# EAGLE design sensor_board_v0.91 (EAGLE 8.0.2)
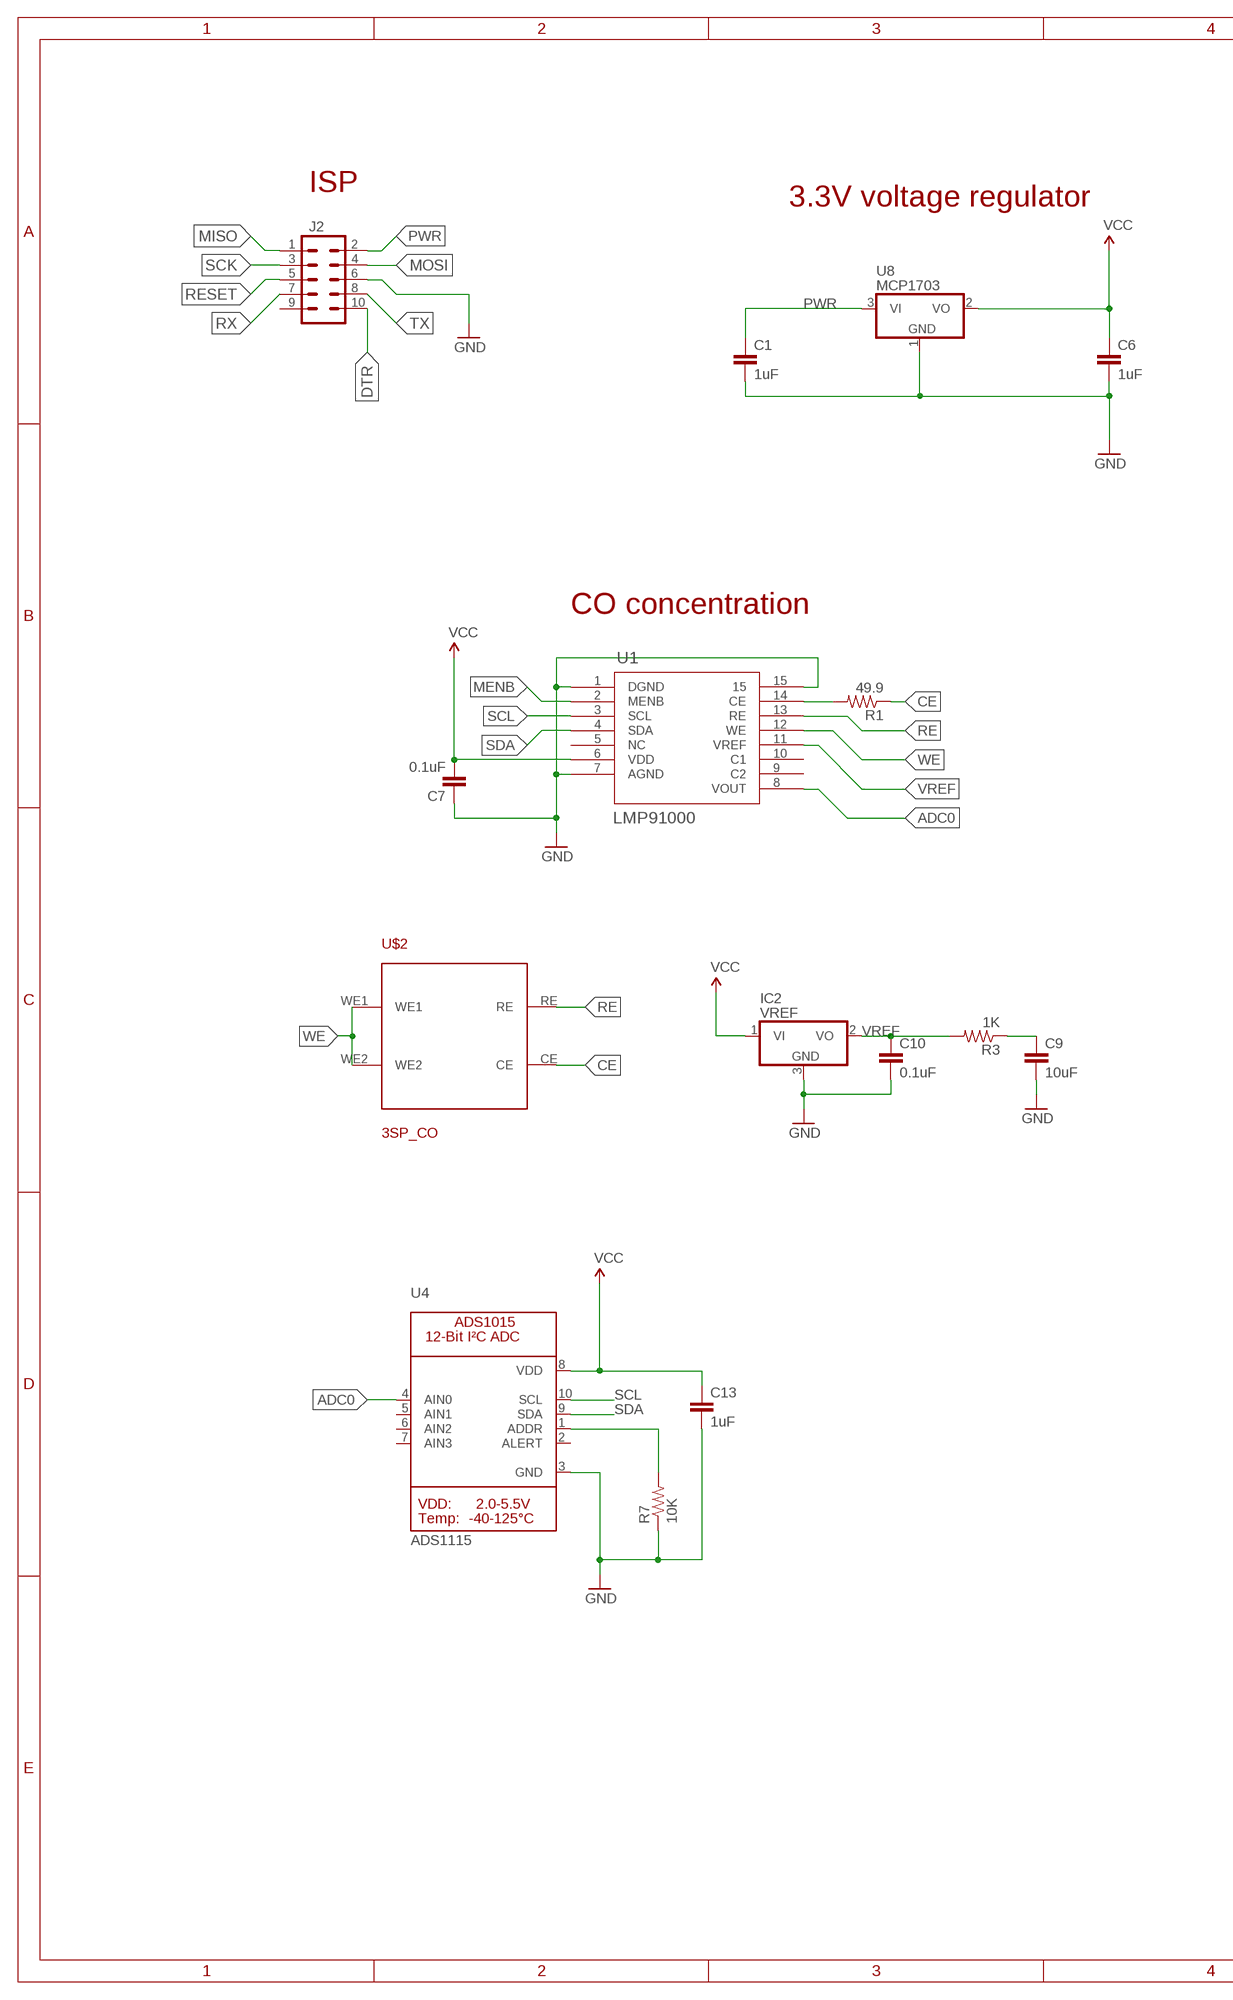
[diagram p0: schematic, sheet 1, part 1 of 2]
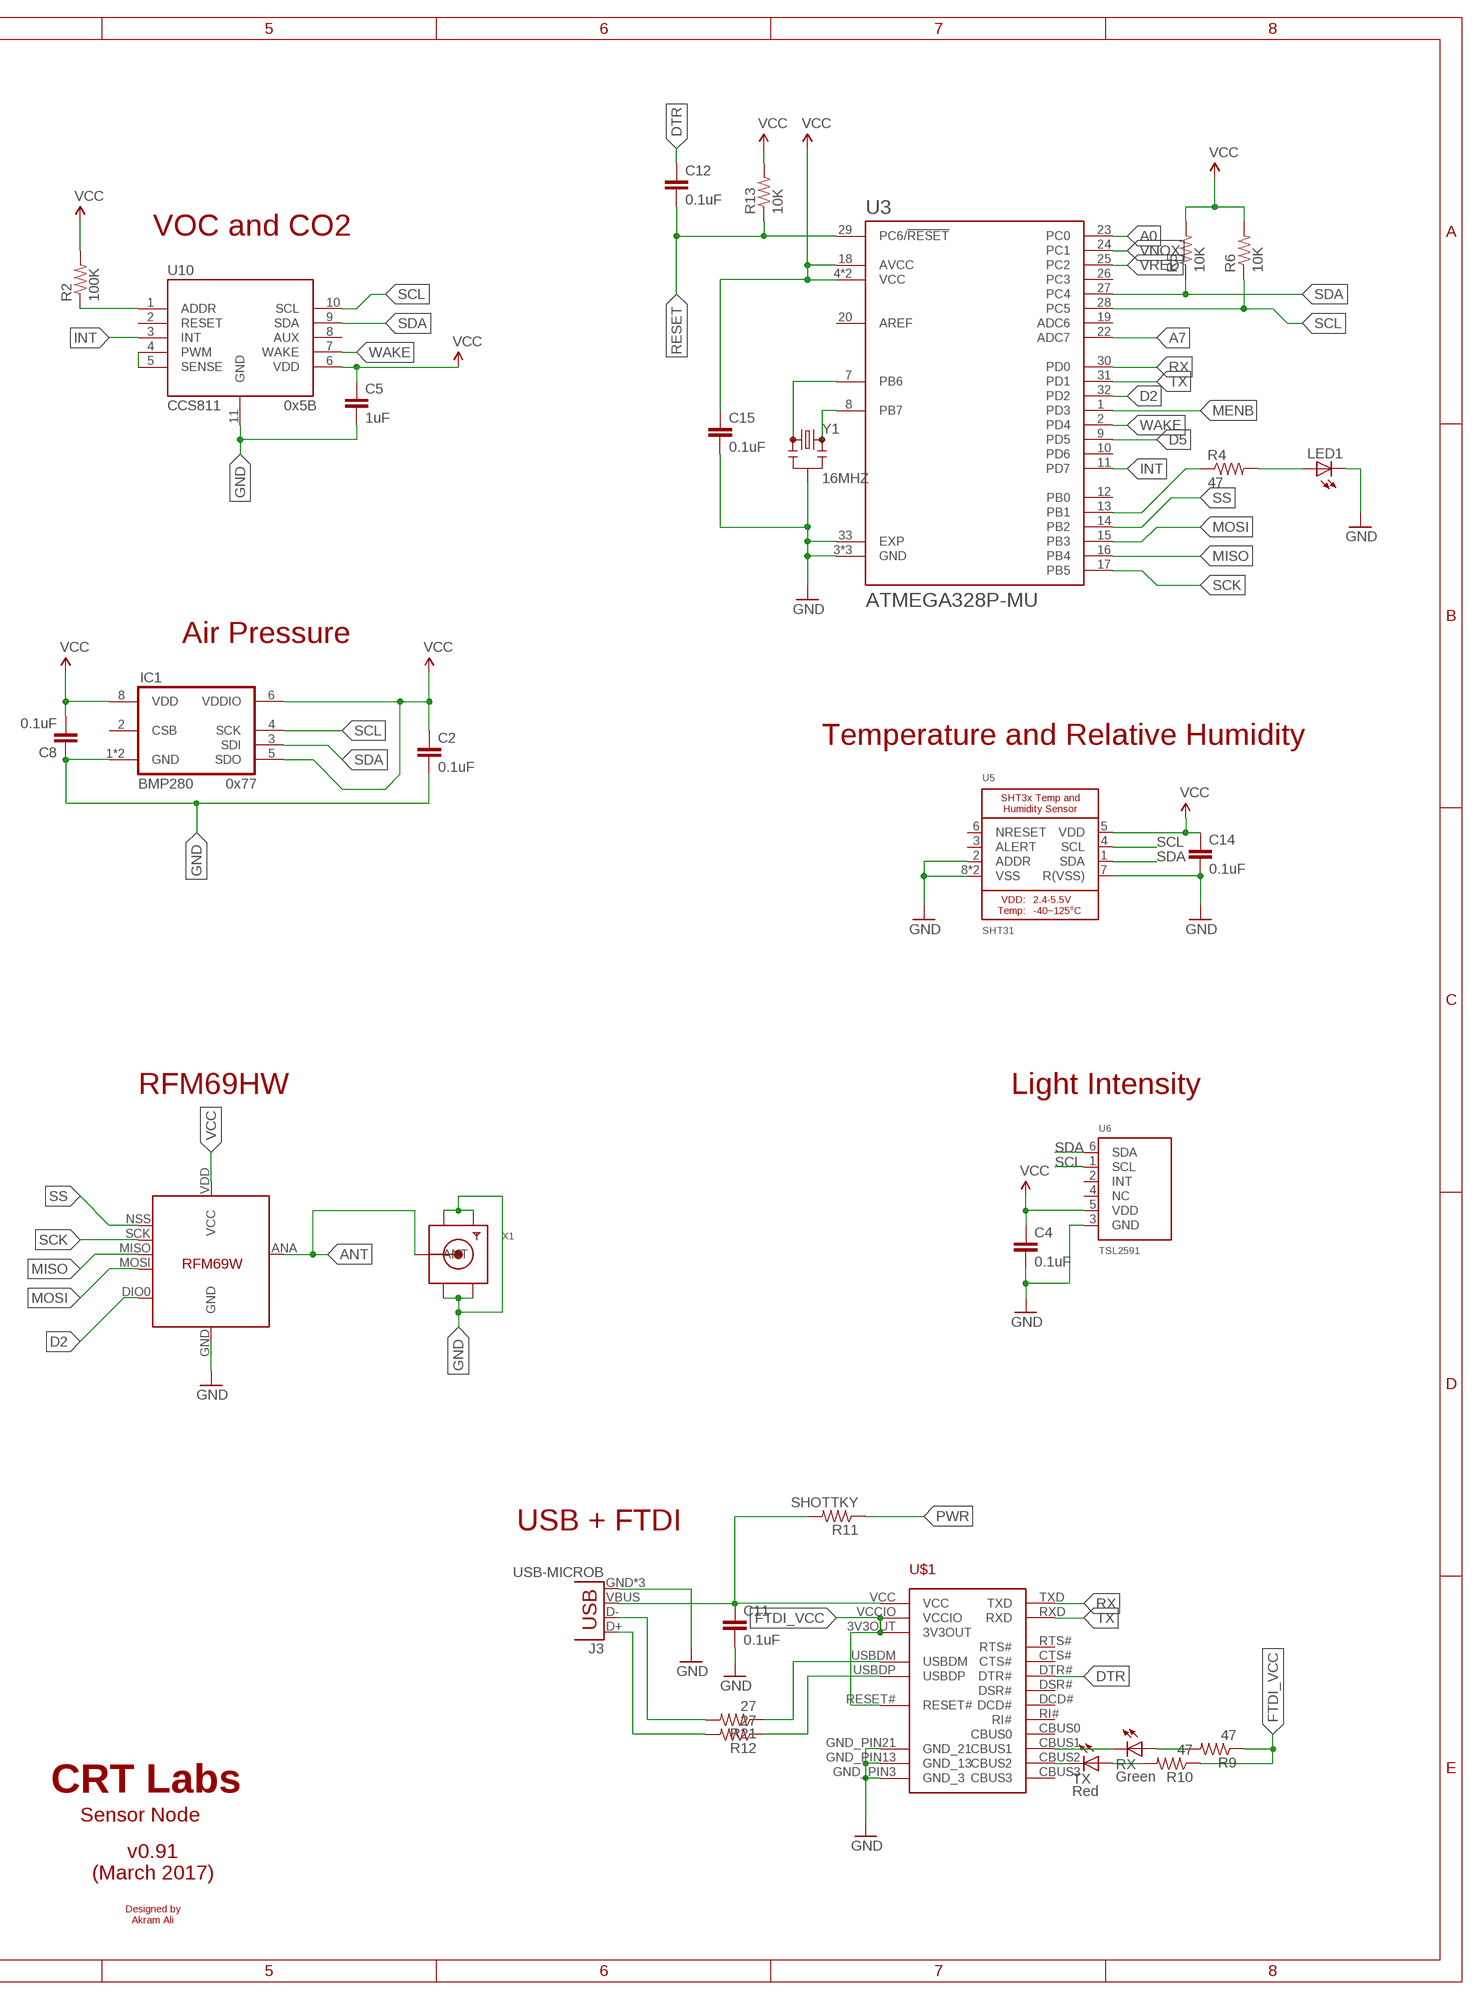
[diagram p1: schematic, sheet 1, part 2 of 2]

## Parts
C1  1uF  CAP0805  [0805]
C2  0.1uF  CAP0805  [0805]
C4  0.1uF  CAP0805  [0805]
C5  1uF  CAP0805  [0805]
C6  1uF  CAP0805  [0805]
C7  0.1uF  CAP0805  [0805]
C8  0.1uF  CAP0805  [0805]
C9  10uF  CAP0805  [0805]
C10  0.1uF  CAP0805  [0805]
C11  0.1uF  CAP0805  [0805]
C12  0.1uF  CAP0805  [0805]
C13  1uF  CAP0805  [0805]
C14  0.1uF  CAP0805  [0805]
C15  0.1uF  CAP0805  [0805]
IC1  BMP280  [BMP280]
IC2  VREF  ISL60002DIH320ZCB  [SOT23]
J2  M05X2PTH  [AVR_ICSP]
J3  USB-MICROB  [USB-MICROB]
LED1  LEDCHIPLED_0805  [CHIPLED_0805]
R1  49.9  RESISTOR0805-RES  [0805]
R2  100K  RESISTOR0805-RES  [0805]
R3  1K  RESISTOR0805-RES  [0805]
R4  47  RESISTOR0805-RES  [0805]
R5  10K  RESISTOR0805-RES  [0805]
R6  10K  RESISTOR0805-RES  [0805]
R7  10K  RESISTOR0805-RES  [0805]
R9  47  RESISTOR0805-RES  [0805]
R10  47  RESISTOR0805-RES  [0805]
R11  SHOTTKY  RESISTOR0805-RES  [0805]
R12  27  RESISTOR0805-RES  [0805]
R13  10K  RESISTOR0805-RES  [0805]
R21  27  RESISTOR0805-RES  [0805]
RX  Green  LEDCHIPLED_0805  [CHIPLED_0805]
TX  Red  LEDCHIPLED_0805  [CHIPLED_0805]
U1  LMP91000  LMP91000_NHL_14  [SDA14B]
U3  ATMEGA328P-MU  [QFN50P500X500X100-33N]
U4  ADS1115  ADC_ADS1015  [MSOP10]
U5  SHT31  SHT3X  [SHT3X]
U6  TSL2591  LIGHT_TSL2591  [DFN6_TAOS]
U8  MCP1703  MCP1703CB  [SOT23]
U10  CCS811  CCS811-I2C  [LGA]
U11  RFM69HW  LOWPOWERLAB_RFM69  [LOWPOWERLAB_RFM69W-MINPADS]
U$1  FT231XQ-R  [FTDI_FT231XQ-R_PACKAGE]
U$2  3SP_CO  [3SP_CO_PIN_PACKAGE]
X1  SMACONNECTOR_EDGE  [SMA_EDGELAUNCH]
Y1  16MHZ  RESONATOR16MHZ  [RESONATOR-SMD]

## Nets
A0: U3.23(PC0)
A7: U3.22(ADC7)
ADC0: U1.8(VOUT) U4.4(AIN0)
ANT: U11.ANA(ANT) X1.P(ANT)
CE: R1.1 U$2.CE
D2: U3.32(PD2) U11.DIO0
D5: U3.9(PD5)
DTR: C12.1 J2.10 U$1.DTR#
FTDI_VCC: R9.1 R10.1 U$1.3V3OUT U$1.RESET# U$1.VCCIO
GND: C1.2 C2.2 C4.2 C5.2 C6.2 C7.1 C8.1 C9.2 C10.2 C11.2 C13.2 C14.2 C15.2 IC1.1(GND) IC1.7(GND) IC2.3(GND) J2.6 J3.GND J3.MT1(GND) J3.MT2(GND) LED1.C R7.1 U1.1(DGND) U1.7(AGND) U1.15 U3.3(GND) U3.5(GND) U3.21(GND) U3.33(EXP) U4.3(GND) U5.2(ADDR) U5.7(R(VSS)) U5.8(VSS) U5.THERMAL(VSS) U6.3(GND) U8.1(GND) U10.11(GND) U11.GND U$1.GND_PIN3(GND_3) U$1.GND_PIN13(GND_13) U$1.GND_PIN21(GND_21) X1.GND@1(GND4) X1.GND@2(GND3) X1.GND@3(GND2) X1.GND@4(GND1) Y1.2
INT: U3.11(PD7) U10.3(INT)
MENB: U1.2(MENB) U3.1(PD3)
MISO: J2.1 U3.16(PB4) U11.MISO
MOSI: J2.4 U3.15(PB3) U11.MOSI
N$1: R2.1 U10.1(ADDR)
N$2: R4.1 U3.13(PB1)
N$3: LED1.A R4.2
N$4: U3.8(PB7) Y1.3
N$5: U3.7(PB6) Y1.1
N$6: U10.4(PWM) U10.5(SENSE)
N$9: R1.2 U1.14(CE)
N$10: C9.1 R3.1
N$13: R7.2 U4.1(ADDR)
N$17: RX.C U$1.CBUS1
N$18: TX.C U$1.CBUS2
N$25: R21.1 U$1.USBDM
N$26: R12.1 U$1.USBDP
N$27: R9.2 RX.A
N$29: R10.2 TX.A
N$32: J3.D- R21.2
N$33: J3.D+ R12.2
PWR: C1.1 J2.2 R11.1 U8.3(VI)
RE: U1.13(RE) U$2.RE
RESET: C12.2 J2.5 R13.1 U3.29(PC6/!RESET)
RX: J2.7 U3.30(PD0) U$1.TXD
SCK: J2.3 U3.17(PB5) U11.SCK
SCL: IC1.4(SCK) R6.1 U1.3(SCL) U3.28(PC5) U4.10(SCL) U5.4(SCL) U6.1(SCL) U10.10(SCL)
SDA: IC1.3(SDI) R5.1 U1.4(SDA) U3.27(PC4) U4.9(SDA) U5.1(SDA) U6.6(SDA) U10.9(SDA)
SS: U3.14(PB2) U11.NSS(SEL)
TX: J2.8 U3.31(PD1) U$1.RXD
VBUS: C11.1 J3.VBUS R11.2 U$1.VCC
VCC: C2.1 C4.1 C5.1 C6.1 C7.2 C8.2 C13.1 C14.1 C15.1 IC1.5(SDO) IC1.6(VDDIO) IC1.8(VDD) IC2.1(VI) R2.2 R5.2 R6.2 R13.2 U1.6(VDD) U3.4(VCC) U3.6(VCC) U3.18(AVCC) U4.8(VDD) U5.5(VDD) U6.5(VDD) U8.2(VO) U10.6(VDD) U11.VDD(VCC)
VNOX: U3.24(PC1)
VRED: U3.25(PC2)
VREF: C10.1 IC2.2(VO) R3.2 U1.11(VREF)
WAKE: U3.2(PD4) U10.7(WAKE)
WE: U1.12(WE) U$2.WE1 U$2.WE2
Unconnected: IC1.2(CSB) J2.9 U1.5(NC) U1.9(C2) U1.10(C1) U3.10(PD6) U3.12(PB0) U3.19(ADC6) U3.20(AREF) U3.26(PC3) U4.2(ALERT) U4.5(AIN1) U4.6(AIN2) U4.7(AIN3) U5.3(ALERT) U5.6(NRESET) U6.2(INT) U6.4(NC) U10.2(RESET) U10.8(AUX) U$1.CBUS0 U$1.CBUS3 U$1.CTS# U$1.DCD# U$1.DSR# U$1.RI# U$1.RTS#

## Notes on the sheet
- ISP
- 3.3V voltage regulator
- VOC and CO2
- 0x5B
- CO concentration
- Air Pressure
- Temperature and Relative Humidity
- 0x77
- RFM69HW | Light Intensity
- USB + FTDI
- CRT Labs
- Sensor Node
- v0.91
  (March 2017)
- Designed by
  Akram Ali

## Library data of the parts
C1 C6 = SparkFun-Capacitors:CAP: Capacitor Standard 0603 ceramic capacitor, and 0.1" leaded capacitor.; MPN: CC0805KKX7R7BB105
C2 C4 C7 C8 C10 C12 C14 C15 = SparkFun-Passives:CAP: Capacitor Standard 0603 ceramic capacitor, and 0.1" leaded capacitor.; MPN: AC0805KRX7R9BB104
C5 C13 = SparkFun-Passives:CAP: Capacitor Standard 0603 ceramic capacitor, and 0.1" leaded capacitor.; MPN: CC0805KKX7R7BB105
C9 = SparkFun-Passives:CAP: Capacitor Standard 0603 ceramic capacitor, and 0.1" leaded capacitor.; MPN: CC0805ZKY5V6BB106
C11 = SparkFun-Capacitors:CAP: Capacitor Standard 0603 ceramic capacitor, and 0.1" leaded capacitor.; MPN: AC0805KRX7R9BB104
IC1 = bosch-bmp280:BMP280: The BMP280 is an absolute barometric pressure sensor especially designed for mobile applications. The sensor module is housed in an extremely compact 8-pin metal-lid LGA package with a footprint of only 2.0 × 2.5 mm2 and 0.95 mm package height. Its small dimensions and its low power consumption of 2.7 μA @1Hz allow the implementation in battery driven devices such as mobile phones, GPS modules or watches. The library has been designed by Richard Magdycz <https://www.facebook.com/groups/eaglecadsoftUK>; MPN: BMP280
IC2 = linear:ISL60002DIH320Z: ISL60002DIH320Z; MPN: ISL60002DIH320Z-TK
J2 = SparkFun-Connectors:M05X2: Header 5x2 Standard 10-pin dual row 0.1" header. Commonly used with AVR-ISP. Use with Spark Fun Electronics SKU: PRT-00778; NO_BOM: TRUE
J3 = SparkFun-Connectors:USB: USB Connectors USB-B-PTH is fully proven SKU : PRT-00139/CONN-08278 USB-miniB is fully proven SKU : PRT-00587 USB-A-PCB is untested. USB-A-H is throughly reviewed, but untested. Spark Fun Electronics SKU : PRT-00437 USB-B-SMT is throughly reviewed, but untested. Needs silkscreen touching up. USB-A-S has not been used/tested USB-MB-H has not been used/tested USB-MICROB has been used. CONN-09505; MPN: CONN-09505; PROD_ID: CONN-09505
LED1 = adafruit:LED: LED OSRAM: - CHIPLED LG R971, LG N971, LY N971, LG Q971, LY Q971, LO R971, LY R971 LH N974, LH R974 LS Q976, LO Q976, LY Q976 LO Q996 - Hyper CHIPLED LW Q18S LB Q993, LB Q99A, LB R99A - SideLED LS A670, LO A670, LY A670, LG A670, LP A670 LB A673, LV A673, LT A673, LW A673 LH A674 LY A675 LS A676, LA A676, LO A676, LY A676, LW A676 LS A679, LY A679, LG A679 - Hyper Micro SIDELED® LS Y876, LA Y876, LO Y876, LY Y876 LT Y87S - SmartLED LW L88C, LW L88S LB L89C, LB L89S, LG L890 LS L89K, LO L89K, LY L89K LS L896, LA L896, LO L896, LY L896 - TOPLED LS T670, LO T670, LY T670, LG T670, LP T670 LSG T670, LSP T670, LSY T670, LOP T670, LYG T670 LG T671, LOG T671, LSG T671 LB T673, LV T673, LT T673, LW T673 LH T674 LS T676, LA T676, LO T676, LY T676, LB T676, LH T676, LSB T676, LW T676 LB T67C, LV T67C, LT T67C, LS T67K, LO T67K, LY T67K, LW E67C LS E67B, LA E67B, LO E67B, LY E67B, LB E67C, LV E67C, LT E67C LW T67C LS T679, LY T679, LG T679 LS T770, LO T770, LY T770, LG T770, LP T770 LB T773, LV T773, LT T773, LW T773 LH T774 LS E675, LA E675, LY E675, LS T675 LS T776, LA T776, LO T776, LY T776, LB T776 LHGB T686 LT T68C, LB T68C - Hyper Mini TOPLED® LB M676 - Mini TOPLED Santana® LG M470 LS M47K, LO M47K, LY M47K Source: http://www.osram.convergy.de/; MPN: 150080BS75000
R1 = SparkFun-Passives:RESISTOR: Resistor Basic schematic elements and footprints for 0603, 1206, and PTH resistors.; MPN: RC0805FR-0749R9L
R2 = SparkFun-Passives:RESISTOR: Resistor Basic schematic elements and footprints for 0603, 1206, and PTH resistors.; MPN: 311-100KCRCT-ND
R3 = SparkFun-Passives:RESISTOR: Resistor Basic schematic elements and footprints for 0603, 1206, and PTH resistors.; MPN: RC0805JR-071KL
R4 = SparkFun-Resistors:RESISTOR: Resistor Basic schematic elements and footprints for 0603, 1206, and PTH resistors.; MPN: RC0805JR-0747RL
R5-R7 = SparkFun-Resistors:RESISTOR: Resistor Basic schematic elements and footprints for 0603, 1206, and PTH resistors.; MPN: RC0805JR-0710KL
R9 R10 = SparkFun-Passives:RESISTOR: Resistor Basic schematic elements and footprints for 0603, 1206, and PTH resistors.; MPN: RC0805JR-0747RL
R11 = SparkFun-Passives:RESISTOR: Resistor Basic schematic elements and footprints for 0603, 1206, and PTH resistors.; MPN: SD0805S020S0R5
R12 R21 = SparkFun-Passives:RESISTOR: Resistor Basic schematic elements and footprints for 0603, 1206, and PTH resistors.; MPN: RC0805FR-0727RL
R13 = SparkFun-Passives:RESISTOR: Resistor Basic schematic elements and footprints for 0603, 1206, and PTH resistors.; MPN: RC0805JR-0710KL
RX = adafruit:LED: LED OSRAM: - CHIPLED LG R971, LG N971, LY N971, LG Q971, LY Q971, LO R971, LY R971 LH N974, LH R974 LS Q976, LO Q976, LY Q976 LO Q996 - Hyper CHIPLED LW Q18S LB Q993, LB Q99A, LB R99A - SideLED LS A670, LO A670, LY A670, LG A670, LP A670 LB A673, LV A673, LT A673, LW A673 LH A674 LY A675 LS A676, LA A676, LO A676, LY A676, LW A676 LS A679, LY A679, LG A679 - Hyper Micro SIDELED® LS Y876, LA Y876, LO Y876, LY Y876 LT Y87S - SmartLED LW L88C, LW L88S LB L89C, LB L89S, LG L890 LS L89K, LO L89K, LY L89K LS L896, LA L896, LO L896, LY L896 - TOPLED LS T670, LO T670, LY T670, LG T670, LP T670 LSG T670, LSP T670, LSY T670, LOP T670, LYG T670 LG T671, LOG T671, LSG T671 LB T673, LV T673, LT T673, LW T673 LH T674 LS T676, LA T676, LO T676, LY T676, LB T676, LH T676, LSB T676, LW T676 LB T67C, LV T67C, LT T67C, LS T67K, LO T67K, LY T67K, LW E67C LS E67B, LA E67B, LO E67B, LY E67B, LB E67C, LV E67C, LT E67C LW T67C LS T679, LY T679, LG T679 LS T770, LO T770, LY T770, LG T770, LP T770 LB T773, LV T773, LT T773, LW T773 LH T774 LS E675, LA E675, LY E675, LS T675 LS T776, LA T776, LO T776, LY T776, LB T776 LHGB T686 LT T68C, LB T68C - Hyper Mini TOPLED® LB M676 - Mini TOPLED Santana® LG M470 LS M47K, LO M47K, LY M47K Source: http://www.osram.convergy.de/; MPN: LG R971-KN-1
TX = adafruit:LED: LED OSRAM: - CHIPLED LG R971, LG N971, LY N971, LG Q971, LY Q971, LO R971, LY R971 LH N974, LH R974 LS Q976, LO Q976, LY Q976 LO Q996 - Hyper CHIPLED LW Q18S LB Q993, LB Q99A, LB R99A - SideLED LS A670, LO A670, LY A670, LG A670, LP A670 LB A673, LV A673, LT A673, LW A673 LH A674 LY A675 LS A676, LA A676, LO A676, LY A676, LW A676 LS A679, LY A679, LG A679 - Hyper Micro SIDELED® LS Y876, LA Y876, LO Y876, LY Y876 LT Y87S - SmartLED LW L88C, LW L88S LB L89C, LB L89S, LG L890 LS L89K, LO L89K, LY L89K LS L896, LA L896, LO L896, LY L896 - TOPLED LS T670, LO T670, LY T670, LG T670, LP T670 LSG T670, LSP T670, LSY T670, LOP T670, LYG T670 LG T671, LOG T671, LSG T671 LB T673, LV T673, LT T673, LW T673 LH T674 LS T676, LA T676, LO T676, LY T676, LB T676, LH T676, LSB T676, LW T676 LB T67C, LV T67C, LT T67C, LS T67K, LO T67K, LY T67K, LW E67C LS E67B, LA E67B, LO E67B, LY E67B, LB E67C, LV E67C, LT E67C LW T67C LS T679, LY T679, LG T679 LS T770, LO T770, LY T770, LG T770, LP T770 LB T773, LV T773, LT T773, LW T773 LH T774 LS E675, LA E675, LY E675, LS T675 LS T776, LA T776, LO T776, LY T776, LB T776 LHGB T686 LT T68C, LB T68C - Hyper Mini TOPLED® LB M676 - Mini TOPLED Santana® LG M470 LS M47K, LO M47K, LY M47K Source: http://www.osram.convergy.de/; MPN: LH R974-LP-1
U1 = LMP91000:LMP91000_NHL_14; BASEPN: LMP91000; DATASHEETURL: http://www.ti.com/lit/ds/symlink/lmp91000.pdf; DESCRIPTION: Configurable AFE Potentiostat for Low-Power Chemical Sensing Applications; MANUFACTURER: Texas Instruments; MANUFACTURER_PART_NUMBER: lmp91000_nhl_14; MPN: LMP91000; NSC_PACKAGEREFERENCE: SDA14B; VENDOR: Texas Instruments
U3 = ATMEGA328P-MU:ATMEGA328P-MU: ATmega Series 20 MHz 32 KB Flash 2 KB SRAM 8-Bit Microcontroller - QFN-32; AVAILABILITY: Good; DESCRIPTION: ATmega Series 20 MHz 32 KB Flash 2 KB SRAM 8-Bit Microcontroller - QFN-32; MF: Atmel; MP: ATMEGA328P-MU; MPN: ATMEGA328P-MU; PACKAGE: QFN-32 Atmel; PRICE: 2.55 USD
U4 = ADS1x15:ADC_ADS1015: ADS1015 - 12-bit 4-Channel I2C ADC with Internal PGA VDD: 2.0-5.5V Sampling Rate: 3.3ksps Gain Settings: 2/3, 1, 2, 4, 8, 16 I2C Address: ADDR low = 1001000x, ADDR high = 1001001x Internal Comparator The ADS1015 includes an internal comparator that can be set to output a high-level on ALERT when the conversion results exceeeds a pre-defined upper level, and will deassert itself when the level falls below a pre-defined lower threshold level. It can also be set to windowed mode where the ALERT pin will be asserted if the data exceeds the upper threshold or falls below the lower threshold.
U5 = SHT31:SHT3X: SHT3x - Digital Temperature and Humidity Sensor Supply Voltage: 2.4-5.5V Humidity Accuracy: SHT30 = +/-3%RH, SHT31 = +/-2%RH Temperature Sensor: -40~125°C (+/-0.3°C from 10-55C)
U6 = TSL2591:LIGHT_TSL2591: TSL2591 Light-To-Digital Sensor
U8 = linear:MCP1703: 250 mA, 16V, Low Quiescent Current LDO Regulator Source: http://ww1.microchip.com/downloads/en/DeviceDoc/22049b.pdf; MPN: MCP1703T-2502E/CB
U10 = CCS811:CCS811; MPN: CCS811
U11 = RFM69 USB Gateway:LOWPOWERLAB_RFM69; MPN: RFM69HW
U$1 = ftdi_ft231xq-r:FT231XQ-R: This is the 20-LD QFN package of the FTDI FT231XQ-R chip.; MPN: FT231XQ-R
U$2 = 3SP_CO:3SP_CO: Spec sensors - CO - Carbon Monoxide Sensor 1000 ppm Pinned Package http://www.spec-sensors.com/product/co-carbon-monoxide-sensor-1000-ppm/ Eagle symbol and footprint designed by Akram Ali https://github.com/AKstudios October 2016; MPN: 3SP CO
X1 = adafruit:SMACONNECTOR: SMA Connector 90° DIP SMA Connector, 50 Ohm (4UConnector: 07259); MPN: WRL-00593
Y1 = SparkFun-FreqCtrl:RESONATOR: Resonator Small SMD resonator. Used, eg, on the Arduino Pro/ Pro Mini boards. 8MHz- XTAL-08895 16MHz- XTAL-08900; MPN: CSTCE16M0V53-R0; PROD_ID: XTAL-08900

## Board
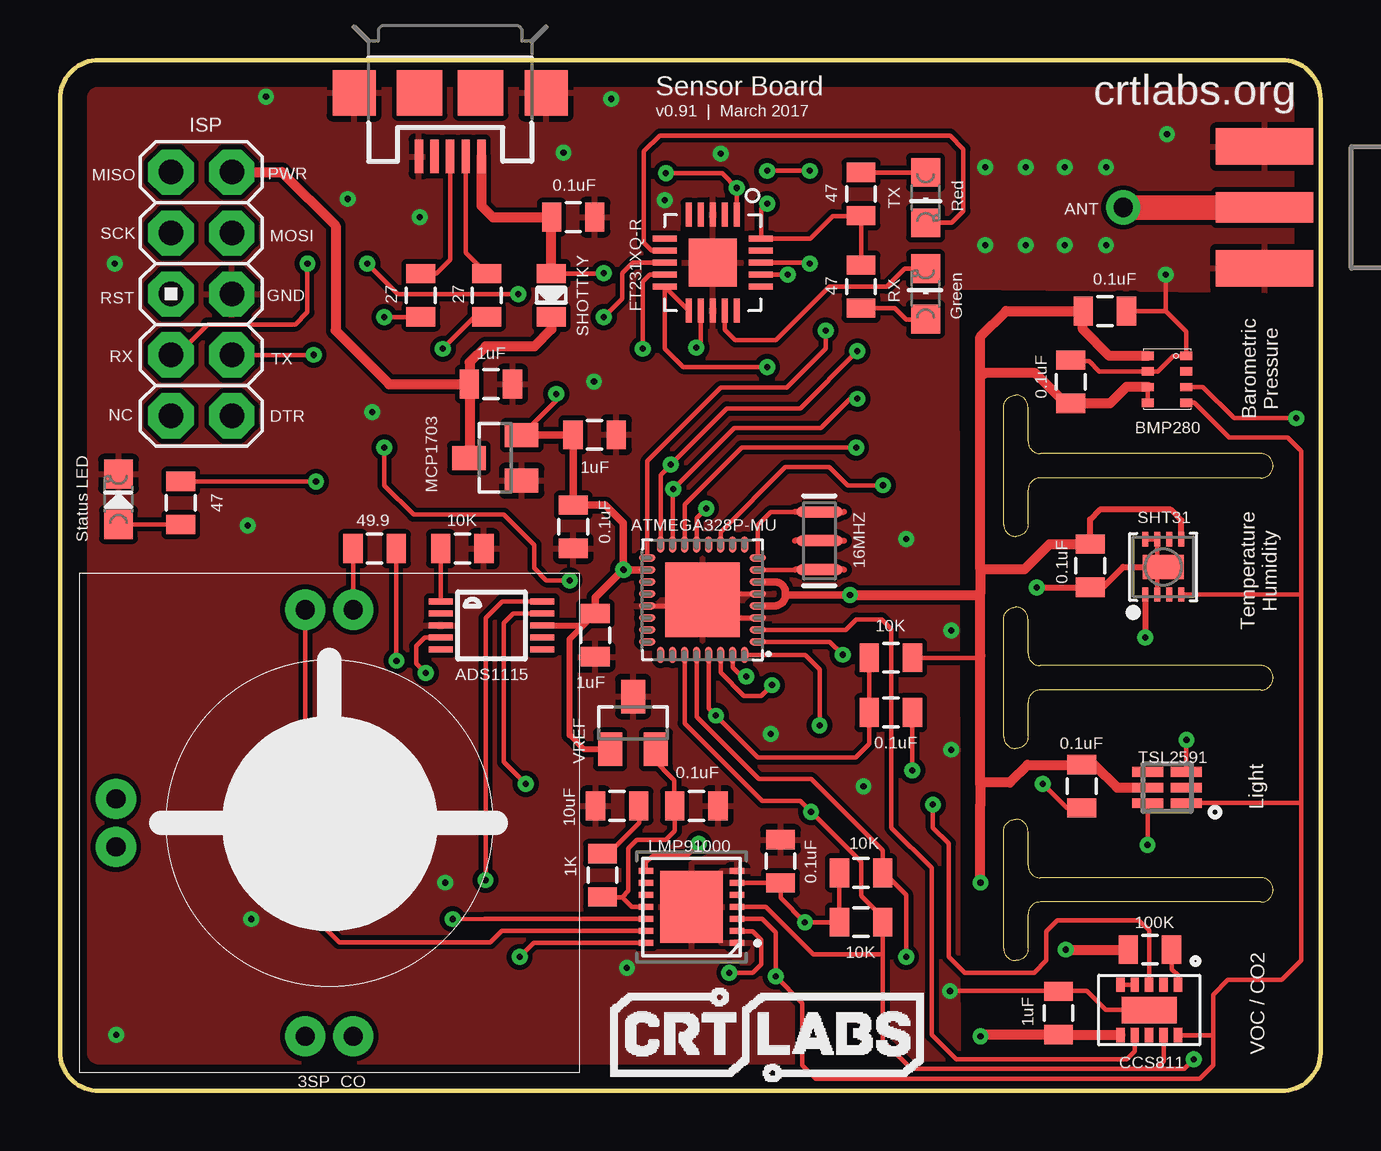
[diagram p2: board, top side]
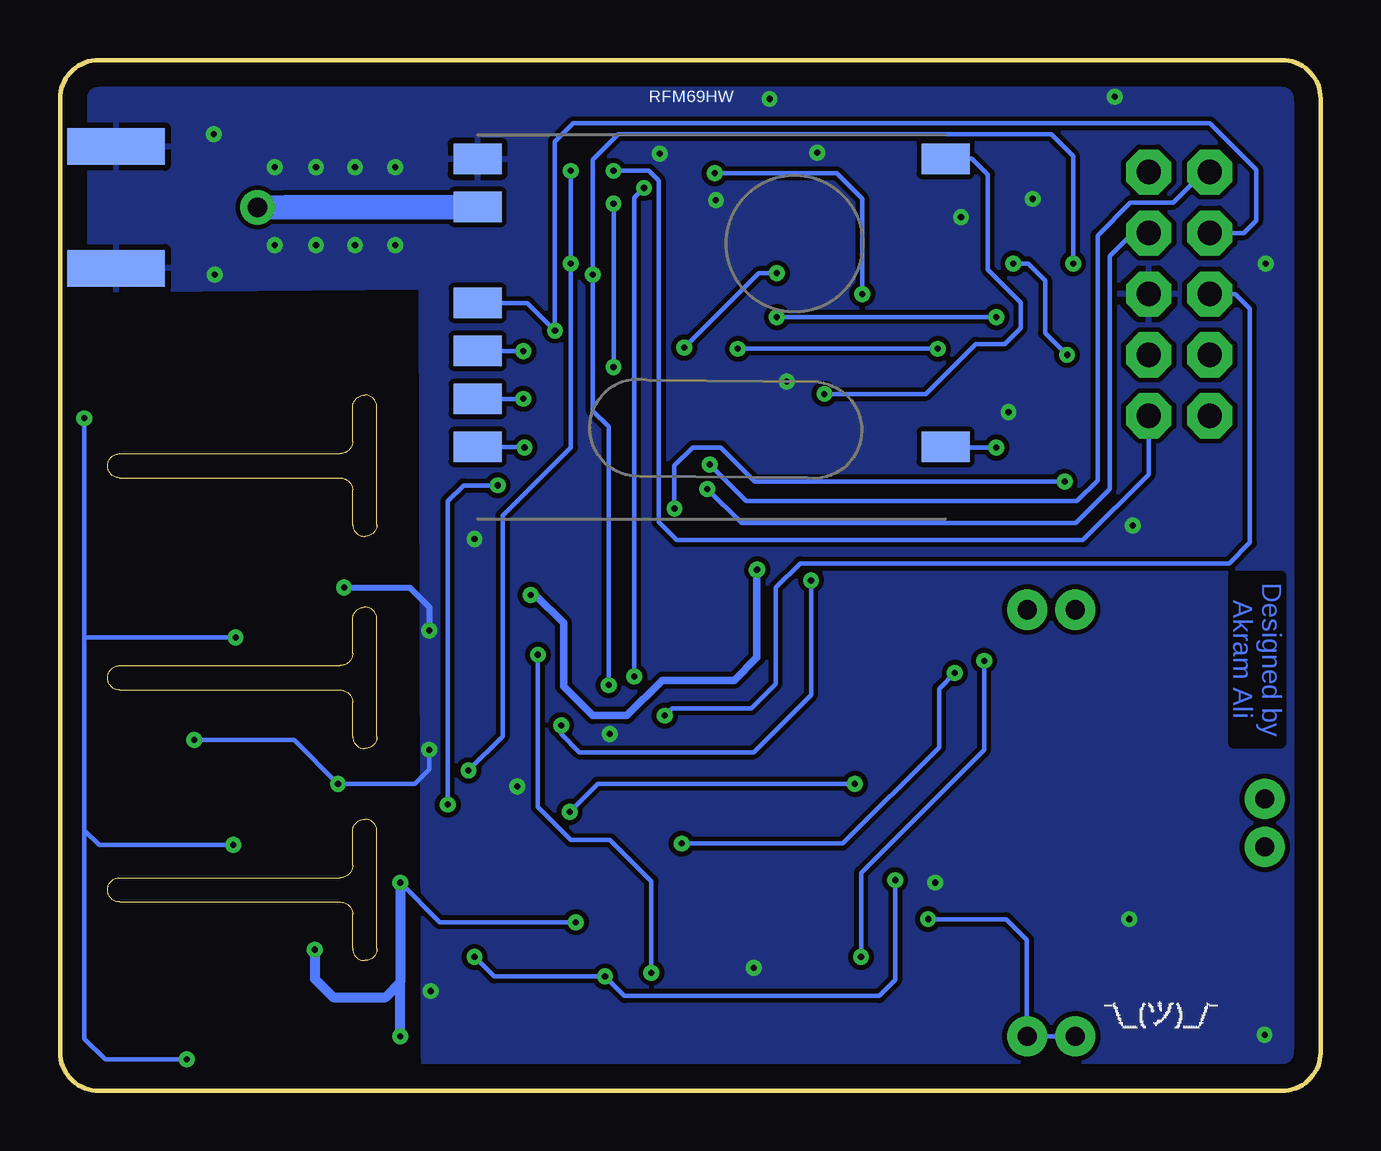
[diagram p3: board, bottom side, seen from below]

Size 52.53 x 42.98 mm. Coordinates in mm from the lower left corner, seen from the top.
Outline: 0,41.35 arc-90 1.63,42.98 50.95,42.98
Outline: 0,1.63 arc90 1.63,0 50.95,0
Outline: 0,41.4 0,1.52
Outline: 50.9,0 arc90 52.53,1.63
Outline: 50.9,42.98 arc-90 52.53,41.35 52.53,1.52
Outline: 50.04,8.89 40.84,8.89 arc-90 40.34,9.4 40.34,10.82 arc90 39.83,11.33 arc90 39.32,10.82 39.32,5.94 arc90 39.83,5.44 arc90 40.34,5.94 40.34,7.37 arc-90 40.84,7.87 50.04,7.87 arc90 50.55,8.38 arc90 50.04,8.89
Outline: 50.04,17.73 40.84,17.73 arc-90 40.34,18.24 40.34,19.66 arc90 39.83,20.17 arc90 39.32,19.66 39.32,14.78 arc90 39.83,14.27 arc90 40.34,14.78 40.34,16.21 arc-90 40.84,16.71 50.04,16.71 arc90 50.55,17.22 arc90 50.04,17.73
Outline: 50.04,26.57 40.84,26.57 arc-90 40.34,27.08 40.34,28.5 arc90 39.83,29.01 arc90 39.32,28.5 39.32,23.62 arc90 39.83,23.11 arc90 40.34,23.62 40.34,25.04 arc-90 40.84,25.55 50.04,25.55 arc90 50.55,26.06 arc90 50.04,26.57
Copper layers (1*16): Top 0.035mm / dielectric 1.5mm / Bottom 0.035mm
Design rules "default": minimum track width 10mil, minimum drill 24mil, track to track 8mil, track to pad 8mil, pad to pad 8mil, via to via 8mil, smd to smd 8mil, copper to edge 40mil, drill to drill 8mil, minimum pad ring 10mil, minimum via ring 8mil, stop-mask expansion 4mil, vias tented up to drill 0mil, thermal gap 10mil

### Footprints (pad centres in the part's own frame; a part is rotated, then mirrored left to right if it is on the bottom)
0805 = smd 0.8 x 1.2: 1 -0.9,0; 2 0.9,0
BMP280 = smd 0.35 x 0.5: 1 0.975,-0.8; 2 0.325,-0.8; 3 -0.325,-0.8; 4 -0.975,-0.8; 5 -0.975,0.8; 6 -0.325,0.8; 7 0.325,0.8; 8 0.975,0.8
SOT23 = smd 1 x 1.4: 1 -0.95,-1.1; 2 0.95,-1.1; 3 0,1.1
AVR_ICSP = drill 1.016 pad 1.88 octagon: 1 -1.27,5.08; 2 1.27,5.08; 3 -1.27,2.54; 4 1.27,2.54; 5 -1.27,0; 6 1.27,0; 7 -1.27,-2.54; 8 1.27,-2.54; 9 -1.27,-5.08; 10 1.27,-5.08
USB-MICROB = smd 0.35 x 1.4: D+ 0,2.65; D- -0.65,2.65; GND 1.3,2.65; ID 0.65,2.65; VBUS -1.3,2.65 | smd 1.8 x 1.9: MT1 -4,0; MT2 4,0 | smd 1.9 x 1.9: P$1 -1.27,0; P$2 1.27,0
CHIPLED_0805 = smd 1.2 x 1.2: A 0,-1.05; C 0,1.05
SDA14B = smd 0.6 x 0.25: 1 -1.9,1.5; 2 -1.9,1; 3 -1.9,0.5; 4 -1.9,0; 5 -1.9,-0.5; 6 -1.9,-1; 7 -1.9,-1.5; 8 1.9,-1.5; 9 1.9,-1; 10 1.9,-0.5; 11 1.9,0; 12 1.9,0.5; 13 1.9,1; 14 1.9,1.5 | smd 2.6 x 3: 15 0,0
QFN50P500X500X100-33N = smd 0.7 x 0.3: 1 -2.3,1.75; 2 -2.3,1.25; 3 -2.3,0.75; 4 -2.3,0.25; 5 -2.3,-0.25; 6 -2.3,-0.75; 7 -2.3,-1.25; 8 -2.3,-1.75; 17 2.3,-1.75; 18 2.3,-1.25; 19 2.3,-0.75; 20 2.3,-0.25; 21 2.3,0.25; 22 2.3,0.75; 23 2.3,1.25; 24 2.3,1.75 | smd 0.3 x 0.7: 9 -1.75,-2.3; 10 -1.25,-2.3; 11 -0.75,-2.3; 12 -0.25,-2.3; 13 0.25,-2.3; 14 0.75,-2.3; 15 1.25,-2.3; 16 1.75,-2.3; 25 1.75,2.3; 26 1.25,2.3; 27 0.75,2.3; 28 0.25,2.3; 29 -0.25,2.3; 30 -0.75,2.3; 31 -1.25,2.3; 32 -1.75,2.3 | smd 3.1 x 3.1: 33 0,0
MSOP10 = smd 0.25 x 1: 1 -1,-2.113; 2 -0.5,-2.113; 3 0,-2.113; 4 0.5,-2.113; 5 1,-2.113; 6 1,2.113; 7 0.5,2.113; 8 0,2.113; 9 -0.5,2.113; 10 -1,2.113
SHT3X = smd 0.6 x 0.25: 1 -1.15,0.75; 2 -1.15,0.25; 3 -1.15,-0.25; 4 -1.15,-0.75; 5 1.15,-0.75; 6 1.15,-0.25; 7 1.15,0.25; 8 1.15,0.75 | smd 1 x 1.7: THERMAL 0,0
DFN6_TAOS = smd 1.3 x 0.4: 1 -0.8,0.65; 2 -0.8,0; 3 -0.8,-0.65; 4 0.8,-0.65; 5 0.8,0; 6 0.8,0.65
LGA = smd 0.6 x 0.35: 1 0.3,3.2; 2 0.3,2.6; 3 0.3,2; 4 0.3,1.4; 5 0.3,0.8; 6 2.4,0.8; 7 2.4,1.4; 8 2.4,2; 9 2.4,2.6; 10 2.4,3.2 | smd 1.1 x 2.3: 11 1.35,2
LOWPOWERLAB_RFM69W-MINPADS = smd 2 x 1.27: ANA 8,-5; DIO0 -11.5,5; GND 8,-7; MISO 8,1; MOSI 8,3; NSS 8,5; SCK 8,-1; VDD -11.5,-7
FTDI_FT231XQ-R_PACKAGE = smd 0.25 x 1: 3V3OUT 0.968,-2.032; CBUS2 -0.532,-2.032; CBUS3 0.968,1.968; CTS# -1.032,-2.032; DTR# -0.032,1.968; RTS# -0.532,1.968; TXD 0.468,1.968; USBDM 0.468,-2.032; USBDP -0.032,-2.032; VCCIO -1.032,1.968 | smd 1 x 0.25: CBUS0 1.968,0.968; CBUS1 1.968,0.468; DCD# -2.032,-1.032; DSR# -2.032,-0.532; GND_PIN3 -2.032,-0.032; GND_PIN13 1.968,-0.032; RESET# 1.968,-1.032; RI# -2.032,0.468; RXD -2.032,0.968; VCC 1.968,-0.532 | smd 2 x 2: GND_PIN21 -0.032,-0.032
3SP_CO_PIN_PACKAGE = drill 0.8 pad 1.676: CE 11.41,19.3; P$3 1.52,11.41; P$4 1.52,9.41; RE 9.41,19.3; WE1 9.41,1.52; WE2 11.41,1.52
SMA_EDGELAUNCH = smd 4.064 x 1.524: GND@1 2.032,-2.54; GND@2 2.032,2.54 | smd 4.064 x 1.524 bottom: GND@3 2.032,2.54; GND@4 2.032,-2.54 | smd 4.064 x 1.27: P 2.032,0
RESONATOR-SMD = smd 0.45 x 1.905: 1 -1.2,0; 2 0,0; 3 1.2,0

### Placement (x,y rotation side)
C1  17.96,29.46 0 top
C2  42.11,29.57 90 top
C4  42.57,12.7 270 top
C5  41.61,3.25 90 top
C6  22.28,27.36 0 top
C7  30.02,9.58 270 top
C8  43.54,32.51 180 top
C9  23.22,11.89 180 top
C10  26.52,11.89 0 top
C11  21.39,36.42 0 top
C12  34.62,15.77 180 top
C13  22.3,19 270 top
C14  42.93,21.89 270 top
C15  21.39,23.52 270 top
IC1  46.13,29.67 90 top
IC2  23.88,15.34 0 top
J2  5.89,33.22 0 top
J3  16.26,41.61 180 top
LED1  2.44,24.66 0 top
R1  13.11,22.61 0 top
R2  45.42,5.89 180 top
R3  22.61,8.99 270 top
R4  5.03,24.51 270 top
R5  33.38,7.04 180 top
R6  33.38,9.09 180 top
R7  16.76,22.61 180 top
R9  33.38,33.53 270 top
R10  33.38,37.39 90 top
R11  20.47,33.17 90 top
R12  15.04,33.17 90 top
R13  34.62,18.06 0 top
R21  17.78,33.17 90 top
RX  36.07,33.22 0 top
TX  36.07,37.24 180 top
U1  26.31,7.67 180 top
U3  26.77,20.47 180 top
U4  17.98,19.41 270 top
U5  45.97,21.84 90 top
U6  46.13,12.65 180 top
U8  18.14,26.39 90 top
U10  43.38,4.72 270 top
U11  27.13,31.85 180 bottom
U$1  27.23,34.49 270 top
U$2  0.81,0.76 0 top
X1  52.22,36.83 180 top
Y1  31.65,22.94 90 top

### Tracks (layer width: path | path; a pad name or v marks a point on that pad's centre or on a via)
ADC0  (via drill 0.25 pad 0.13)
  Top 0.178: U1.8 24.41,9.53 24.69,9.8 26.11,9.8 v26.62,10.31 | v15.24,17.42 14.83,17.83 14.83,18.54 15.2,18.91 U4.4
  Bottom 0.178: v26.62,10.31 19.91,10.31 15.9,14.33 15.9,16.76 v15.24,17.42
ANT  (via drill 0.8 pad 1.42)
  Top 1.016: v44.3,36.83 X1.P
  Bottom 1.016: U11.ANA 43.11,36.85 v44.3,36.83
CE
  Top 0.178: U$2.CE 12.22,22.59 R1.1
D2  (via drill 0.25 pad 0.13)
  Top 0.178: U3.32 31.05,18.17 31.65,17.58 v31.65,15.24 | v13.51,26.82 13.51,25.25 14.73,24.03 18.49,24.03 19.76,22.76 19.76,21.79 20.27,21.29 v21.23,21.29
  Bottom 0.178: 15.65,26.83 U11.DIO0 15.6,26.82 v13.51,26.82 | v31.65,15.24 31.65,14.88 30.89,14.12 23.62,14.12 21.23,16.51 v21.23,21.29
DTR  (via drill 0.25 pad 0.13)
  Top 0.178: U$1.DTR# 31.21,34.53 v31.24,34.49 | v31.24,38.35 v29.46,38.35 | C12.1 35.52,13.37 v35.51,13.36
  Bottom 0.178: J2.10 7.16,25.7 9.91,22.96 26.82,22.96 27.58,23.72 27.58,37.95 27.99,38.35 v29.46,38.35 | v31.24,38.35 v31.24,34.49 31.24,26.82 34.09,23.98 34.09,14.78 v35.51,13.36
FTDI_VCC  (via drill 0.25 pad 0.13)
  Top 0.178: R9.1 R10.1 33.36,36.47 32.21,36.47 31.26,35.53 U$1.VCCIO 29.21,35.54 29.21,36.78 29.41,36.98 v29.46,36.98 | v29.46,30.18 25.96,30.18 25.2,30.94 U$1.3V3OUT U$1.RESET#
  Bottom 0.178: v29.46,30.18 v29.46,36.98
GND  (via drill 0.25 pad 0.13)
  Top 0.178: U10.11 43.56,3.37 42.77,4.17 41.62,4.17 | 41.62,4.17 C5.2 | 46.11,34 v46.08,34.04 46.08,32.51 | C2.2 42.15,30.43 42.88,30.43 43.31,29.99 IC1.7 45.74,29.99 46.39,30.64 IC1.1 46.93,31.66 46.08,32.51 | 45.67,32.51 C8.1 46.08,32.51 | U3.5 27.02,20.72 U3.33 | U3.3 27.52,19.72 U3.33 | 41.62,4.17 v37.08,4.17 | U3.21 26.52,20.22 U3.33 | U5.8 U5.7 45.72,22.09 U5.THERMAL 45.72,21.59 U5.2 | C4.2 41.95,11.8 v40.94,12.8 | U6.3 v46.93,14.62 v46.94,14.63
  Top 0.254: U5.THERMAL 44.3,21.84 43.45,20.99 C14.2 42.91,20.98 v40.69,20.98
  Bottom 0.178: v37.13,14.22 37.13,13.41 37.74,12.8 v40.94,12.8 42.77,14.63 v46.94,14.63
  Bottom 0.254: v37.13,19.2 37.13,20.17 37.95,20.98 v40.69,20.98
  other vias: 40.23,38.51 27.53,39.07 7.98,7.16 11.99,37.19 13,28.3 16.05,8.69 22.25,29.57 7.82,23.57 2.34,2.34 38.56,38.51 41.86,38.51 43.59,38.51 43.59,35.26 41.86,35.26 40.23,35.26 38.56,35.26 20.98,39.12 2.29,34.49 23.62,5.13 35.26,23.01 22.96,41.35 46.13,39.88 8.59,41.45 25.2,37.13 14.99,36.42 29.62,14.88 33.48,12.7
  pour Top: -1.17,45.57 55.63,45.36 55.78,33.27 37.39,33.48 37.44,-2.29 17.88,-2.29 17.22,-2.24 -2.03,-2.24 -1.42,40.89
  pour Bottom: -1.32,45.57 55.58,45.42 55.73,33.32 37.49,33.48 37.39,-2.18 17.68,-2.18 17.73,-2.13 -1.57,-2.13 -1.47,41
INT  (via drill 0.25 pad 0.13)
  Top 0.178: U10.3 45.38,6.69 44.96,7.11 41.55,7.11 41.1,6.65 41.1,5.44 40.59,4.93 37.69,4.93 37.03,5.59 37.03,10.31 36.37,10.97 v36.37,11.94 | v34.29,25.25 32.82,25.25 32.05,26.01 30.23,26.01 27.52,23.31 U3.11
  Bottom 0.178: v36.37,11.94 36.37,24.59 35.71,25.25 v34.29,25.25
MENB  (via drill 0.25 pad 0.13)
  Top 0.178: U3.1 32.08,18.72 v32.61,18.19 | U1.2 28.23,6.65 28.85,6.65 29.21,6.3 29.21,5.28 28.85,4.93 v27.89,4.93
  Bottom 0.178: v27.89,4.93 27.89,8.74 29.62,10.46 31.24,10.46 32.61,11.84 v32.61,18.19
MISO  (via drill 0.25 pad 0.13)
  Top 0.178: v33.22,30.84 30.84,28.45 27.79,28.45 v25.45,26.11 25.02,25.68 U3.16
  Bottom 0.178: U11.MISO 33.24,30.85 v33.22,30.84 | J2.1 4.88,38.3 6.15,37.03 7.92,37.03 9.3,35.66 9.3,25.45 10.16,24.59 23.93,24.59 v25.45,26.11
MOSI  (via drill 0.25 pad 0.13)
  Top 0.178: v33.22,28.85 32.92,28.85 31.7,27.64 28.09,27.64 v25.55,25.1 25.52,25.06 U3.15
  Bottom 0.178: U11.MOSI v33.23,28.85 v33.22,28.85 | J2.4 7.82,35.76 8.79,34.8 8.79,25.1 10.21,23.67 24.13,23.67 v25.55,25.1
N$1
  Top 0.178: U10.1 | 46.33,6.13 R2.1 46.33,5.88 46.33,5.08 46.58,4.83 U10.1
N$2  (via drill 0.25 pad 0.13)
  Top 0.178: U3.13 26.52,23.88 v26.92,24.28 | v10.67,25.4 R4.1
  Bottom 0.178: v10.67,25.4 23.57,25.4 24.99,26.82 26.16,26.82 26.92,26.06 v26.92,24.28
N$3
  Top 0.178: R4.2 LED1.A
N$4
  Top 0.178: U3.8 29.07,23.59 29.62,24.13 30.63,24.13 30.63,24.14
N$5
  Top 0.178: U3.7 30.62,21.72 30.63,21.74
N$6
  Top 0.178: U10.5 U10.4
N$9  (via drill 0.25 pad 0.13)
  Top 0.178: v14.02,17.93 v14.01,17.95 R1.2 | U1.14 19.73,6.17 v19.15,5.59
  Bottom 0.178: v19.15,5.59 19.15,9.09 14.02,14.22 v14.02,17.93
N$10
  Top 0.178: R3.1 22.85,9.89 24.13,11.18 24.13,11.87 C9.1
N$13
  Top 0.178: R7.2 U4.1
N$17
  Top 0.178: RX.C 35.19,34.27 34.44,33.53 32.05,33.53 29.82,31.29 28.14,31.29 27.7,31.74 U$1.CBUS1
N$18
  Top 0.178: TX.C 37.15,36.19 37.64,36.68 37.64,39.27 37.08,39.83 24.99,39.83 24.33,39.17 24.33,35.36 24.66,35.03 U$1.CBUS2
N$25  (via drill 0.25 pad 0.13)
  Top 0.178: R21.1 17.29,32.27 v15.95,30.94 | U$1.USBDM 24.58,34.03 24.28,33.73 v24.28,30.94
  Bottom 0.178: v15.95,30.94 v24.28,30.94
N$26  (via drill 0.25 pad 0.13)
  Top 0.178: v13.51,32.26 15.02,32.26 R12.1 | U$1.USBDP 23.86,34.53 23.42,34.09 23.42,33.02 v22.66,32.26
  Bottom 0.178: v13.51,32.26 v22.66,32.26
N$27
  Top 0.178: R9.2 34.78,32.63 35.26,32.16 36.05,32.16 RX.A
N$29
  Top 0.178: TX.A R10.2
N$32
  Top 0.178: J3.D- 16.91,34.95 R21.2
N$33
  Top 0.178: R12.2 15.68,34.07 16.26,34.65 J3.D+
PWR
  Top 0.406: R11.1 20.47,31.75 19.76,31.04 17.73,31.04 17.07,30.38 17.07,29.48 | 17.07,29.48 C1.1 13.72,29.46 11.48,31.7 11.48,36.07 9.25,38.3 J2.2 | 17.07,29.48 17.07,26.42 U8.3
RE
  Top 0.178: U1.13 18.41,6.67 17.93,6.2 11.63,6.2 10.22,7.61 U$2.RE
RESET  (via drill 0.25 pad 0.13)
  Top 0.178: U3.29 27.02,15.96 v27.33,15.65 29.08,13.89 33.15,13.89 33.72,14.47 C12.2 R13.1
  Bottom 0.178: J2.5 3.56,33.22 2.95,32.61 2.95,22.86 3.81,22 21.69,22 22.71,20.98 22.71,16.97 23.72,15.95 27.03,15.95 v27.33,15.65
RX  (via drill 0.25 pad 0.13)
  Top 0.178: J2.7 4.88,30.68 6.15,31.95 9.8,31.95 10.31,32.46 v10.31,34.49 | U3.30 27.52,17.44 28.5,16.46 29.21,16.46 v29.67,16.92 | U$1.TXD v30.32,34.03 v30.33,34.04
  Bottom 0.178: v29.67,16.92 29.67,27.69 30.33,28.35 v30.33,34.04 30.33,38.81 29.26,39.88 11.23,39.88 10.31,38.96 v10.31,34.49
SCK  (via drill 0.25 pad 0.13)
  Top 0.178: v31.9,31.7 31.9,30.94 30.28,29.31 27.53,29.31 24.47,26.25 U3.17
  Bottom 0.178: U11.SCK 33.05,32.85 v31.9,31.7 31.9,39.57 31.14,40.34 4.62,40.34 2.69,38.4 2.69,36.27 3.2,35.76 J2.3
SCL  (via drill 0.25 pad 0.13)
  Top 0.178: 51.71,12.04 51.71,20.68 | 51.71,12.04 51.71,5.44 50.9,4.62 48.67,4.62 48.06,4.01 48.06,2.34 | 51.71,20.68 51.71,26.67 51.16,27.23 48.72,27.23 47.25,28.69 IC1.4 | U10.10 | U3.28 26.52,15.59 29.11,13 31.29,13 34.28,10.02 R6.1 34.34,9.09 35.26,8.18 v35.26,5.59 | U1.3 29.25,7.17 29.82,6.6 v29.82,4.78 30.94,3.66 30.94,1.07 31.5,0.51 47.5,0.51 48.06,1.07 48.06,2.34 | U4.10 18.42,20.41 17.73,19.71 v17.73,8.79 | U5.4 51.7,20.69 51.71,20.68 | U6.1 51.67,12 51.71,12.04 | U10.10 48.04,2.32 48.06,2.34
  Bottom 0.178: v35.26,5.59 34.44,4.78 v29.82,4.78 29.01,3.96 18.39,3.96 17.73,4.62 v17.73,8.79
SDA  (via drill 0.25 pad 0.13)
  Top 0.178: v51.51,28.04 48.92,28.04 47.62,29.34 IC1.3 | U3.27 26.02,15.33 29.26,12.09 30.84,12.09 v31.29,11.63 33.38,9.55 33.38,8.13 34.28,7.23 R5.1 34.28,5.74 | 34.28,5.74 34.28,2.1 35.46,0.91 45.67,0.91 | U1.4 29.41,7.67 31.39,5.69 34.22,5.69 34.28,5.74 | U4.9 18.89,19.91 18.49,19.51 18.49,13.72 v19.41,12.8 | U6.6 v45.33,10.27 v45.31,10.26 | v47.24,1.32 46.84,0.91 45.67,0.91 | U10.9 45.98,1.23 45.67,0.91
  Top 0.254: U5.1 45.22,18.91 v45.21,18.9
  Bottom 0.178: 51.51,10.87 50.9,10.26 v45.31,10.26 | 51.51,10.87 51.51,18.95 | v45.21,18.9 51.46,18.9 51.51,18.95 | 51.51,18.95 v51.51,28.04 | v19.41,12.8 30.12,12.8 v31.29,11.63 | v47.24,1.32 50.65,1.32 51.51,2.18 51.51,10.87
SS  (via drill 0.25 pad 0.13)
  Top 0.178: v33.17,26.82 28.4,26.82 26.02,24.45 U3.14
  Bottom 0.178: U11.NSS 33.2,26.85 v33.17,26.82
TX  (via drill 0.25 pad 0.13)
  Top 0.178: v10.57,30.68 J2.8 | v12.8,34.49 14.07,33.22 v19.1,33.22 | U3.31 28.02,17.65 28.4,17.27 v28.6,17.27 | U$1.RXD v28.2,37.64 v28.19,37.64 27.58,38.25 v25.25,38.25
  Bottom 0.178: v12.8,34.49 12.19,34.49 11.48,33.78 11.48,31.6 v10.57,30.68 | v28.6,17.27 28.6,37.24 v28.19,37.64 | v25.25,38.25 20.17,38.25 19.1,37.19 v19.1,33.22
VBUS  (via drill 0.25 pad 0.13)
  Top 0.178: R11.2 22.64,34.07 v22.66,34.09 | U$1.VCC 26.7,31.17 v26.52,30.99
  Top 0.406: J3.VBUS 17.56,36.9 18.03,36.42 C11.1 20.47,36.41 R11.2
  Bottom 0.178: v22.66,34.09 23.42,34.09 v26.52,30.99
VCC  (via drill 0.25 pad 0.13)
  Top 0.178: 41.63,2.32 C5.1 | 38.42,2.35 v38.35,2.29 | 38.28,11.86 38.35,11.94 | v20.68,29.06 20.68,28.78 U8.2 | IC1.5 IC1.6 | R13.2 38.28,18.06 38.35,18.14 | U1.6 C7.2 30.02,8.05 v31.04,7.04 R5.2 R6.2
  Top 0.254: U4.8 21.81,19.41 | 21.81,19.41 C13.1 | IC2.1 21.83,14.24 21.23,14.83 21.23,18.83 21.81,19.41 | U5.5 46.72,23.79 46.28,24.23 43.33,24.23 42.93,23.83 C14.1
  Top 0.305: U8.2 21.36,27.34 | v23.47,21.74 v23.49,21.72 U3.18 | U3.6 29.78,21.22 arc-90 30.23,20.78 30.23,20.68 | U3.4 29.77,20.22 arc90 30.23,20.68 | 30.23,20.68 v32.92,20.68 | C6.1 21.38,24.43 C15.1 22.72,24.42 23.47,23.67 v23.47,21.74 | v23.47,21.74 22.3,20.57 C13.1
  Top 0.406: 21.36,27.34 C6.1 | U10.6 41.63,2.32 | C5.1 38.42,2.35 | v38.35,8.69 38.35,11.94 38.35,12.75 | 38.35,12.75 38.35,18.14 38.35,20.78 | 38.35,21.74 38.35,20.78 | 38.35,21.74 38.35,29.77 | 38.35,29.77 38.35,31.45 39.42,32.51 C8.2 | 38.35,29.77 38.51,29.92 40.64,29.92 41.9,28.67 C2.1 43.75,28.67 44.43,29.34 IC1.6 | 42.67,32.48 C8.2 | C8.2 42.62,32.5 42.62,31.75 43.73,30.64 IC1.8 | v41.91,5.89 R2.2 | v32.92,20.68 38.25,20.68 38.35,20.78 | C14.1 41.24,22.79 40.18,21.74 38.35,21.74 | 38.35,12.75 38.46,12.85 39.57,12.85 40.32,13.6 C4.1 43.09,13.6 44.04,12.65 U6.5
  Bottom 0.178: v20.68,29.06 16.46,29.06 14.38,31.14 13.16,31.14 12.5,31.8 12.5,32.87 13.87,34.24 13.87,38.2 14.53,38.86 U11.VDD | v31.04,7.04 36.7,7.04 v38.35,8.69
  Bottom 0.305: v23.49,21.72 23.49,18.06 24.43,17.12 27.43,17.12 28.91,15.65 30.33,15.65 31.55,16.87 31.55,19.51 32.72,20.68 v32.92,20.68
  Bottom 0.406: v41.91,5.89 41.91,4.67 41.15,3.91 38.96,3.91 38.35,4.52 | v38.35,8.69 38.35,4.52 | v38.35,2.29 38.35,4.52
VREF
  Top 0.178: IC2.2 24.67,14.09 24.67,13.88 25.6,12.95 25.6,11.9 C10.1 25.62,10.83 25.25,10.46 24.03,10.46 23.67,10.11 23.67,8.33 23.42,8.08 | U1.11 23.83,7.67 23.42,8.08 | 23.42,8.08 22.62,8.08 R3.2
WAKE
  Top 0.178: U10.7 44.78,1.65 44.45,1.32 37.34,1.32 36.32,2.34 36.32,9.3 34.65,10.97 34.65,19.25 34.24,19.66 33.17,19.66 32.74,19.22 U3.2
WE  (via drill 0.25 pad 0.13)
  Top 0.178: U1.12 17.69,7.17 v16.36,7.16
  Bottom 0.178: U$2.WE1 U$2.WE2 12.24,2.3 12.24,6.3 13.11,7.16 v16.36,7.16

### Text on the board
Bottom: Designed by / Akram Ali
_tsilk: Sensor Board | crtlabs.org | v0.91 | March 2017 | ISP | MISO | PWR | ANT | SCK | MOSI | RST | GND | RX | TX | Barometric / Pressure | NC | DTR | Status LED | Temperature / Humidity | Light | VOC / CO2